# EAGLE schematic GSM_module_v1.0 (EAGLE 6.2)
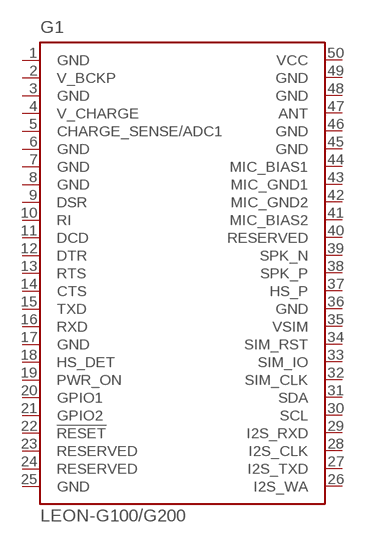
[diagram p0: schematic, sheet 1]

## Parts
G1  LEON-G100/G200  [LEON-G100/G200]
Unconnected: G1.2(V_BCKP) G1.4(V_CHARGE) G1.5(CHARGE_SENSE/ADC1) G1.9(DSR) G1.10(RI) G1.11(DCD) G1.12(DTR) G1.13(RTS) G1.14(CTS) G1.15(TXD) G1.16(RXD) G1.18(HS_DET) G1.19(PWR_ON) G1.20(GPIO1) G1.21(GPIO2) G1.22(!RESET) G1.23(RESERVED) G1.24(RESERVED) G1.26(I2S_WA) G1.27(I2S_TXD) G1.28(I2S_CLK) G1.29(I2S_RXD) G1.30(SCL) G1.31(SDA) G1.32(SIM_CLK) G1.33(SIM_IO) G1.34(SIM_RST) G1.35(VSIM) G1.37(HS_P) G1.38(SPK_P) G1.39(SPK_N) G1.40(RESERVED) G1.41(MIC_BIAS2) G1.42(MIC_GND2) G1.43(MIC_GND1) G1.44(MIC_BIAS1) G1.47(ANT)

## Power pins joined to a net without a drawn wire
GND: G1.1(GND) G1.3(GND) G1.6(GND) G1.7(GND) G1.8(GND) G1.17(GND) G1.25(GND) G1.36(GND) G1.45(GND) G1.46(GND) G1.48(GND) G1.49(GND)
VCC: G1.50(VCC)

## Library data of the parts
G1 = u-blox:LEON-G100/G200: LEON-G100/G200 Quad Band GSM/GPRS Voice and Data Modules Source: http://www.u-blox.com; OC_FARNELL: unknown; OC_NEWARK: unknown